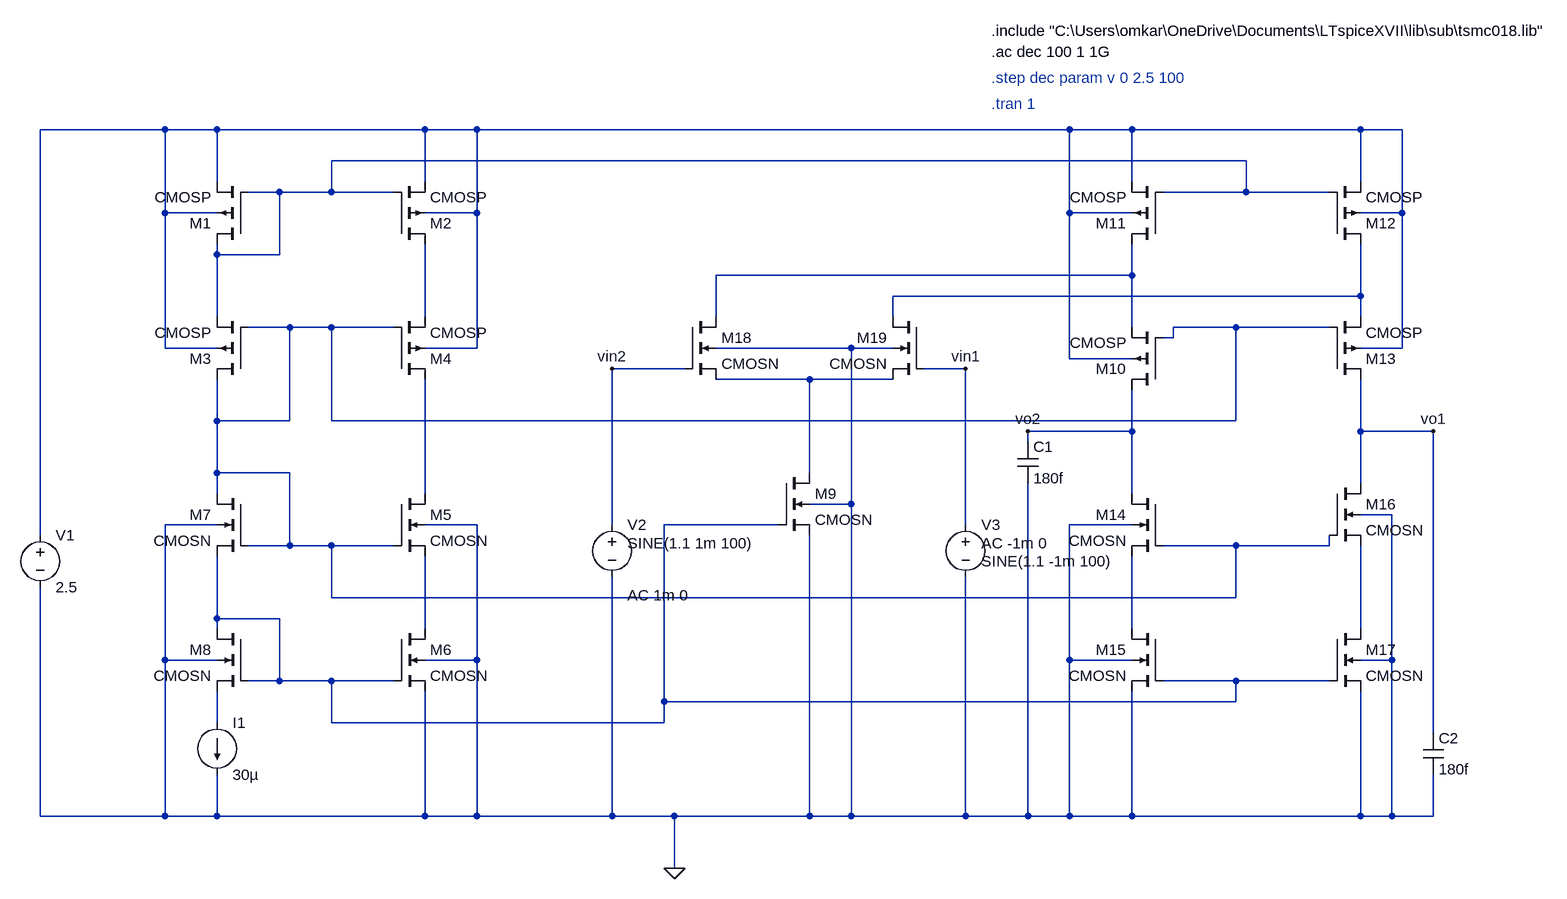
[diagram p0: schematic Draft2.asc]
Draft2.asc, the LTspice schematic file:
Version 4
SHEET 1 2516 680
WIRE -16 -480 -208 -480
WIRE 64 -480 -16 -480
WIRE 384 -480 64 -480
WIRE 464 -480 384 -480
WIRE 1376 -480 464 -480
WIRE 1472 -480 1376 -480
WIRE 1824 -480 1472 -480
WIRE 1888 -480 1824 -480
WIRE 1648 -432 240 -432
WIRE 64 -400 64 -480
WIRE 384 -400 384 -480
WIRE 1472 -400 1472 -480
WIRE 1824 -400 1824 -480
WIRE 160 -384 112 -384
WIRE 240 -384 240 -432
WIRE 240 -384 160 -384
WIRE 336 -384 240 -384
WIRE 1648 -384 1648 -432
WIRE 1648 -384 1520 -384
WIRE 1776 -384 1648 -384
WIRE -16 -352 -16 -480
WIRE 64 -352 -16 -352
WIRE 464 -352 464 -480
WIRE 464 -352 384 -352
WIRE 1376 -352 1376 -480
WIRE 1472 -352 1376 -352
WIRE 1888 -352 1888 -480
WIRE 1888 -352 1824 -352
WIRE 64 -288 64 -304
WIRE 160 -288 160 -384
WIRE 160 -288 64 -288
WIRE 1472 -256 1472 -304
WIRE 1472 -256 832 -256
WIRE 1824 -224 1824 -304
WIRE 1824 -224 1104 -224
WIRE 64 -192 64 -288
WIRE 384 -192 384 -304
WIRE 832 -192 832 -256
WIRE 1104 -192 1104 -224
WIRE 1824 -192 1824 -224
WIRE 176 -176 112 -176
WIRE 240 -176 176 -176
WIRE 336 -176 240 -176
WIRE 1472 -176 1472 -256
WIRE 1632 -176 1536 -176
WIRE 1776 -176 1632 -176
WIRE 1536 -160 1536 -176
WIRE 1536 -160 1520 -160
WIRE -16 -144 -16 -352
WIRE 64 -144 -16 -144
WIRE 464 -144 464 -352
WIRE 464 -144 384 -144
WIRE 1040 -144 832 -144
WIRE 1104 -144 1040 -144
WIRE 1888 -144 1888 -352
WIRE 1888 -144 1824 -144
WIRE 1376 -128 1376 -352
WIRE 1472 -128 1376 -128
WIRE 784 -112 672 -112
WIRE 1216 -112 1152 -112
WIRE 976 -96 832 -96
WIRE 1104 -96 976 -96
WIRE 64 -32 64 -96
WIRE 176 -32 176 -176
WIRE 176 -32 64 -32
WIRE 240 -32 240 -176
WIRE 1632 -32 1632 -176
WIRE 1632 -32 240 -32
WIRE 1472 -16 1472 -80
WIRE 1472 -16 1312 -16
WIRE 1824 -16 1824 -96
WIRE 1936 -16 1824 -16
WIRE 1312 0 1312 -16
WIRE 64 48 64 -32
WIRE 176 48 64 48
WIRE 976 48 976 -96
WIRE 1824 64 1824 -16
WIRE 64 80 64 48
WIRE 384 80 384 -96
WIRE 1472 80 1472 -16
WIRE 1040 96 1040 -144
WIRE 1040 96 976 96
WIRE 1872 112 1824 112
WIRE 64 128 -16 128
WIRE 464 128 384 128
WIRE 672 128 672 -112
WIRE 928 128 752 128
WIRE 1216 128 1216 -112
WIRE 1472 128 1376 128
WIRE -208 144 -208 -480
WIRE 176 160 176 48
WIRE 176 160 112 160
WIRE 240 160 176 160
WIRE 336 160 240 160
WIRE 1632 160 1520 160
WIRE 1776 160 1776 144
WIRE 1776 160 1632 160
WIRE 240 240 240 160
WIRE 1632 240 1632 160
WIRE 1632 240 240 240
WIRE 64 272 64 176
WIRE 160 272 64 272
WIRE 64 288 64 272
WIRE 384 288 384 176
WIRE 1472 288 1472 176
WIRE 1824 288 1824 160
WIRE -16 336 -16 128
WIRE 64 336 -16 336
WIRE 464 336 464 128
WIRE 464 336 384 336
WIRE 1376 336 1376 128
WIRE 1472 336 1376 336
WIRE 1872 336 1872 112
WIRE 1872 336 1824 336
WIRE 160 368 160 272
WIRE 160 368 112 368
WIRE 240 368 160 368
WIRE 336 368 240 368
WIRE 1632 368 1520 368
WIRE 1776 368 1632 368
WIRE 752 400 752 128
WIRE 1632 400 1632 368
WIRE 1632 400 752 400
WIRE 64 432 64 384
WIRE 240 432 240 368
WIRE 752 432 752 400
WIRE 752 432 240 432
WIRE 1936 448 1936 -16
WIRE -208 576 -208 224
WIRE -16 576 -16 336
WIRE -16 576 -208 576
WIRE 64 576 64 512
WIRE 64 576 -16 576
WIRE 384 576 384 384
WIRE 384 576 64 576
WIRE 464 576 464 336
WIRE 464 576 384 576
WIRE 672 576 672 208
WIRE 672 576 464 576
WIRE 768 576 672 576
WIRE 976 576 976 144
WIRE 976 576 768 576
WIRE 1040 576 1040 96
WIRE 1040 576 976 576
WIRE 1216 576 1216 208
WIRE 1216 576 1040 576
WIRE 1312 576 1312 64
WIRE 1312 576 1216 576
WIRE 1376 576 1376 336
WIRE 1376 576 1312 576
WIRE 1472 576 1472 384
WIRE 1472 576 1376 576
WIRE 1824 576 1824 384
WIRE 1824 576 1472 576
WIRE 1872 576 1872 336
WIRE 1872 576 1824 576
WIRE 1936 576 1936 512
WIRE 1936 576 1872 576
WIRE 768 656 768 576
FLAG 768 656 0
FLAG 1936 -16 vo1
FLAG 1312 -16 vo2
FLAG 1216 -112 vin1
FLAG 672 -112 vin2
SYMBOL cmosp 112 -304 R180
SYMATTR InstName M1
SYMATTR Value2 l=1u w=43u
SYMBOL cmosp 336 -304 M180
SYMATTR InstName M2
SYMATTR Value2 l=1u w=43u
SYMBOL cmosp 112 -96 R180
SYMATTR InstName M3
SYMATTR Value2 l=1u w=37.019u
SYMBOL cmosp 336 -96 M180
SYMATTR InstName M4
SYMATTR Value2 l=1u w=37.019u
SYMBOL cmosn 336 80 R0
SYMATTR InstName M5
SYMATTR Value2 l=1u w=9.25u
SYMBOL cmosn 336 288 R0
SYMATTR InstName M6
SYMATTR Value2 l=1u w=30u
SYMBOL cmosn 112 80 M0
SYMATTR InstName M7
SYMATTR Value2 l=1u w=9.25u
SYMBOL cmosn 112 288 M0
SYMATTR InstName M8
SYMATTR Value2 l=1u w=30u
SYMBOL cmosn 928 48 R0
SYMATTR InstName M9
SYMATTR Value2 l=1u w=240u
SYMBOL cmosp 1520 -80 R180
SYMATTR InstName M10
SYMATTR Value2 l=1u w=21u
SYMBOL cmosp 1520 -304 R180
SYMATTR InstName M11
SYMATTR Value2 l=1u w=215u
SYMBOL cmosp 1776 -304 M180
SYMATTR InstName M12
SYMATTR Value2 l=1u w=215u
SYMBOL cmosp 1776 -96 M180
SYMATTR InstName M13
SYMATTR Value2 l=1u w=21u
SYMBOL cmosn 1520 80 M0
SYMATTR InstName M14
SYMATTR Value2 l=1u w=16u
SYMBOL cmosn 1520 288 M0
SYMATTR InstName M15
SYMATTR Value2 l=1u w=30u
SYMBOL cmosn 1776 64 R0
SYMATTR InstName M16
SYMATTR Value2 l=1u w=16u
SYMBOL cmosn 1776 288 R0
SYMATTR InstName M17
SYMATTR Value2 l=1u w=30u
SYMBOL cmosn 784 -192 R0
SYMATTR InstName M18
SYMATTR Value2 l=1u w=30u
SYMBOL cmosn 1152 -192 M0
SYMATTR InstName M19
SYMATTR Value2 l=1u w=30u
SYMBOL voltage -208 128 R0
WINDOW 123 0 0 Left 0
WINDOW 39 0 0 Left 0
SYMATTR InstName V1
SYMATTR Value 2.5
SYMBOL voltage 672 112 R0
WINDOW 123 24 124 Left 2
WINDOW 39 0 0 Left 0
WINDOW 3 24 44 Left 2
SYMATTR Value2 AC 1m 0
SYMATTR InstName V2
SYMATTR Value SINE(1.1 1m 100)
SYMBOL voltage 1216 112 R0
WINDOW 123 24 44 Left 2
WINDOW 39 0 0 Left 0
WINDOW 3 24 72 Left 2
SYMATTR Value2 AC -1m 0
SYMATTR InstName V3
SYMATTR Value SINE(1.1 -1m 100)
SYMBOL current 64 432 R0
WINDOW 123 0 0 Left 0
WINDOW 39 0 0 Left 0
SYMATTR InstName I1
SYMATTR Value 30µ
SYMBOL cap 1296 0 R0
SYMATTR InstName C1
SYMATTR Value 180f
SYMBOL cap 1920 448 R0
SYMATTR InstName C2
SYMATTR Value 180f
TEXT 1256 -632 Left 2 !.include "C:\\Users\\omkar\\OneDrive\\Documents\\LTspiceXVII\\lib\\sub\\tsmc018.lib"
TEXT 1256 -600 Left 2 !.ac dec 100 1 1G
TEXT 1256 -560 Left 2 ;.step dec param v 0 2.5 100
TEXT 1256 -520 Left 2 ;.tran 1

The netlist it stands for:
* Draft2.asc
M1 N002 N002 N001 N001 CMOSP l=1u w=43u
M2 N005 N002 N001 N001 CMOSP l=1u w=43u
M3 N006 N006 N002 N001 CMOSP l=1u w=37.019u
M4 N008 N006 N005 N001 CMOSP l=1u w=37.019u
M5 N008 N006 N010 0 CMOSN l=1u w=9.25u
M6 N010 N009 0 0 CMOSN l=1u w=30u
M7 N006 N006 N009 0 CMOSN l=1u w=9.25u
M8 N009 N009 N013 0 CMOSN l=1u w=30u
M9 N007 N009 0 0 CMOSN l=1u w=240u
M10 vo2 N006 N003 N001 CMOSP l=1u w=21u
M11 N003 N002 N001 N001 CMOSP l=1u w=215u
M12 N004 N002 N001 N001 CMOSP l=1u w=215u
M13 vo1 N006 N004 N001 CMOSP l=1u w=21u
M14 vo2 N006 N011 0 CMOSN l=1u w=16u
M15 N011 N009 0 0 CMOSN l=1u w=30u
M16 vo1 N006 N012 0 CMOSN l=1u w=16u
M17 N012 N009 0 0 CMOSN l=1u w=30u
M18 N003 vin2 N007 0 CMOSN l=1u w=30u
M19 N004 vin1 N007 0 CMOSN l=1u w=30u
V1 N001 0 2.5
V2 vin2 0 SINE(1.1 1m 100) AC 1m 0
V3 vin1 0 SINE(1.1 -1m 100) AC -1m 0
I1 N013 0 30µ
C1 vo2 0 180f
C2 vo1 0 180f
.model NMOS NMOS
.model PMOS PMOS
.lib standard.mos
.include "C:\Users\omkar\OneDrive\Documents\LTspiceXVII\lib\sub\tsmc018.lib"
.ac dec 100 1 1G
* .step dec param v 0 2.5 100
* .tran 1
.backanno
.end